# EAGLE design SAS_rev04 (EAGLE 7.5.0)
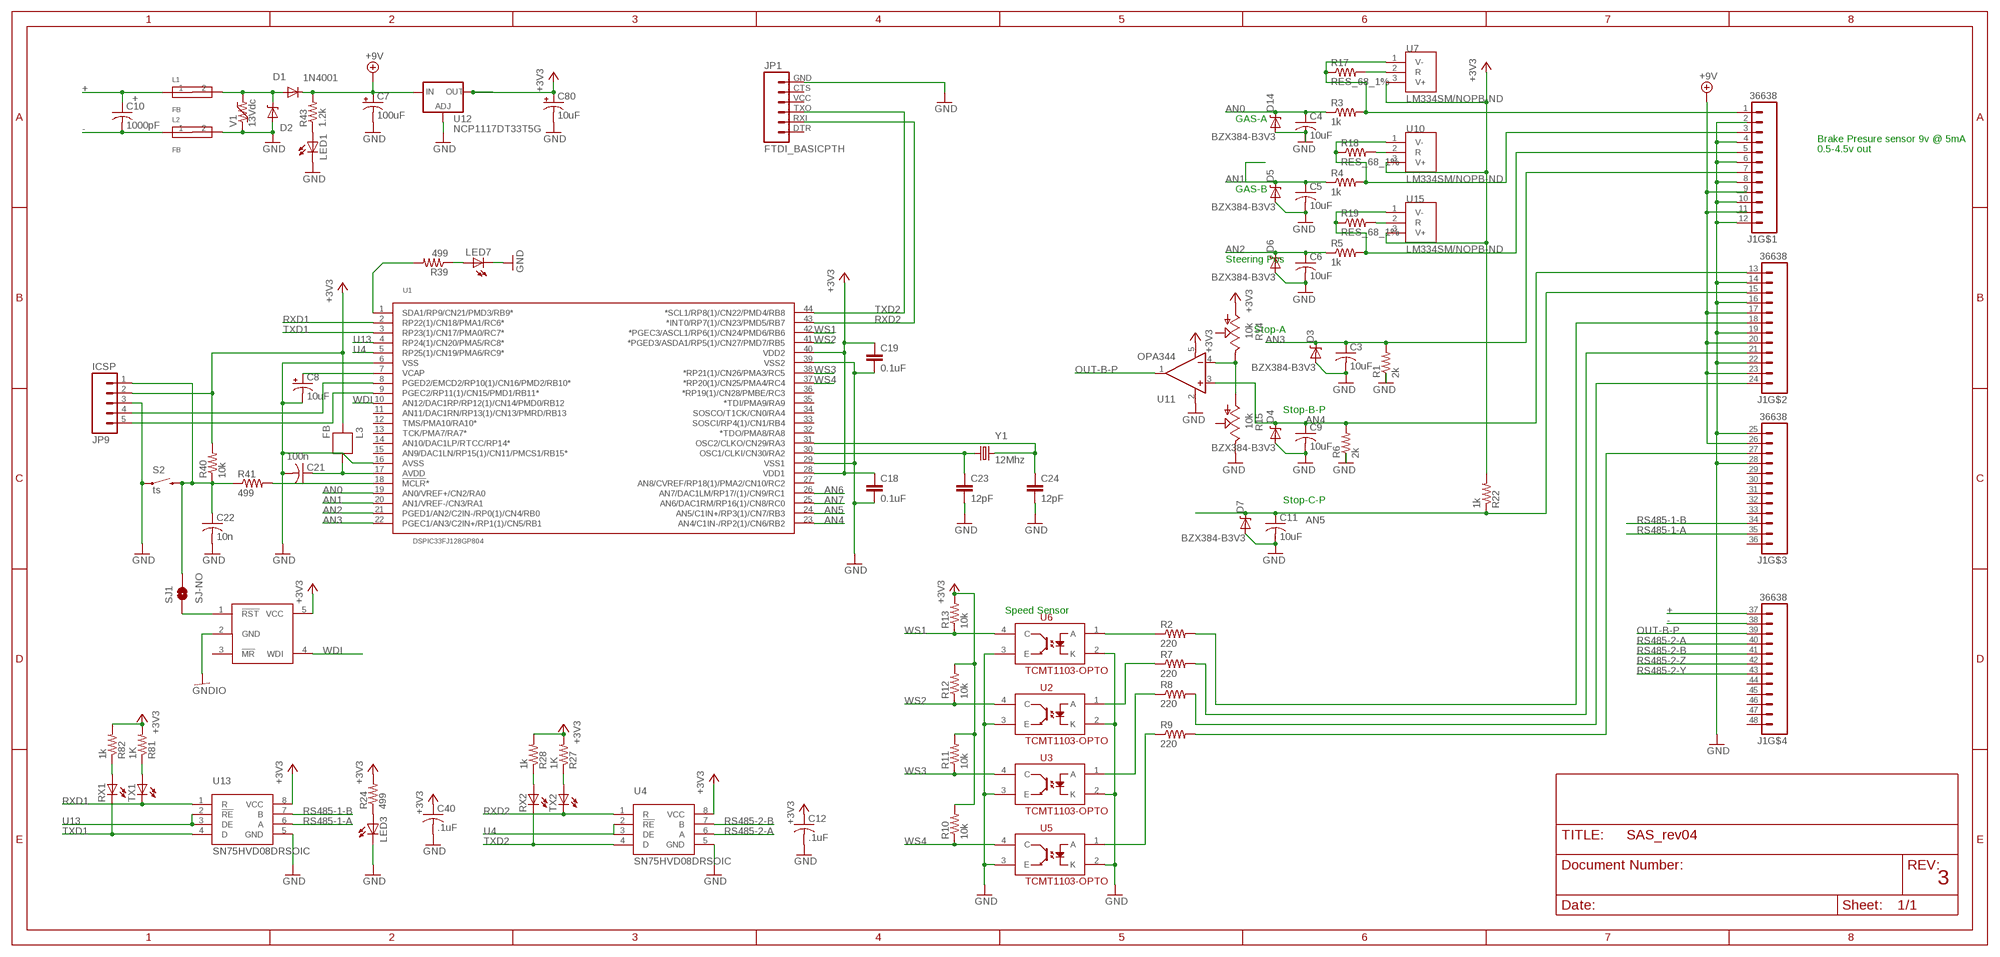
[diagram p0: schematic, sheet 1]

## Parts
C3  10uF  C-USC0805  [C0805]
C4  10uF  C-USC0805  [C0805]
C5  10uF  C-USC0805  [C0805]
C6  10uF  C-USC0805  [C0805]
C7  100uF  CAP_POL7343  [EIA7343]
C8  10uF  CAP-POL_10UF_16V  [EIA3216-16V]
C9  10uF  C-USC0805  [C0805]
C10  1000pF  C-USC1825  [C1825]
C11  10uF  C-USC0805  [C0805]
C12  .1uF  CAP_0.1UF_50V  [0603]
C18  0.1uF  CAP0805  [0805]
C19  0.1uF  CAP0805  [0805]
C21  100n  C-USC0805  [C0805]
C22  10n  CAP_10NF_50V  [0603]
C23  12pF  CAP0805  [0805]
C24  12pF  CAP0805  [0805]
C40  .1uF  CAP_0.1UF_50V  [0603]
C80  10uF  POLCAP  [POLC1206]
D1  1N4001  DIODE-SOD123  [SOD123]
D2  MM5Z30  [SOD-523F]
D3  BZX384-B3V3  DIODE-ZENER-BZT52  [SOD-323]
D4  BZX384-B3V3  DIODE-ZENER-BZT52  [SOD-323]
D5  BZX384-B3V3  DIODE-ZENER-BZT52  [SOD-323]
D6  BZX384-B3V3  DIODE-ZENER-BZT52  [SOD-323]
D7  BZX384-B3V3  DIODE-ZENER-BZT52  [SOD-323]
D14  BZX384-B3V3  DIODE-ZENER-BZT52  [SOD-323]
J1  36638  [36638]
JP1  FTDI_BASICPTH  [FTDI_BASIC]
JP9  ICSP  M05LOCK_LONGPADS  [1X05_LOCK_LONGPADS]
L1  FB  FERITEBEAD  [0603]
L2  FB  FERITEBEAD  [0603]
L3  FB  [0603]
LED1  LEDCHIP-LED0805  [CHIP-LED0805]
LED3  LEDCHIP-LED0805  [CHIP-LED0805]
LED7  LEDCHIP-LED0805  [CHIP-LED0805]
R1  2k  RES_2K_1%_0805  [0805]
R2  220  RES_220_1%  [0603]
R3  1k  RES_1K_5%  [0603]
R4  1k  RES_1K_5%  [0603]
R5  1k  RES_1K_5%  [0603]
R6  2k  RES_2K_1%_0805  [0805]
R7  220  RES_220_1%  [0603]
R8  220  RES_220_1%  [0603]
R9  220  RES_220_1%  [0603]
R10  10k  RES_10K_1%  [0603]
R11  10k  RES_10K_1%  [0603]
R12  10k  RES_10K_1%  [0603]
R13  10k  RES_10K_1%  [0603]
R14  10k  POT_10K_POT  [PVG3]
R15  10k  POT_10K_POT  [PVG3]
R17  RES_68_1%  [0603]
R18  RES_68_1%  [0603]
R19  RES_68_1%  [0603]
R22  1k  RES_1K_1%_0805  [0805]
R24  499  RES_499_1%  [0603]
R27  1K  RES_1K_1%_0805  [0805]
R28  1k  RES_1K_1%_0805  [0805]
R39  499  RES_499_1%  [0603]
R40  10k  RES_10K_1%_0805  [0805]
R41  499  RES_499_1%_0805  [0805]
R43  1.2k  RES_1.2K_1%_0805  [0805]
R81  1K  RES_1K_5%  [0603]
R82  1k  RES_1K_5%  [0603]
RX1  LEDCHIPLED_0805  [CHIPLED_0805]
RX2  LEDCHIPLED_0805  [CHIPLED_0805]
S2  ts  SWITCH-MOMENTARY-2PTH  [TACTILE-PTH]
SJ1  SJ-NO  SOLDERJUMPERNO  [SJ_2S-NO]
TX1  LEDCHIPLED_0805  [CHIPLED_0805]
TX2  LEDCHIPLED_0805  [CHIPLED_0805]
U1  DSPIC33FJ128GP804  [TQFP-44]
U2  TCMT1103-OPTO  [SSOP-4]
U3  TCMT1103-OPTO  [SSOP-4]
U4  SN75HVD08DRSOIC  [SO-8]
U5  TCMT1103-OPTO  [SSOP-4]
U6  TCMT1103-OPTO  [SSOP-4]
U7  LM334SM/NOPB-ND  [SO-8]
U9  MAX823  [SOT23-5L]
U10  LM334SM/NOPB-ND  [SO-8]
U11  OPA344  [SOT23-5]
U12  NCP1117DT33T5G  V_REG_317DPACK  [V-REG_DPACK]
U13  SN75HVD08DRSOIC  [SO-8]
U15  LM334SM/NOPB-ND  [SO-8]
V1  13Vdc  VAR-RES  [0603]
Y1  12Mhz  CRYSTAL5X3  [CRYSTAL-SMD-5X3]

## Nets
+: C10.1 J1.37 L1.1
+3V3: C12.1(+) C18.1 C19.1 C40.1(+) C80.1(+) JP9.2 L3.2 R10.2 R11.2 R12.2 R13.2 R14.1(CW) R22.2 R24.2 R27.2 R28.2 R40.2 R81.2 R82.2 U1.28(VDD1) U1.40(VDD2) U4.8(VCC) U7.3(V+) U9.5(VCC) U10.3(V+) U11.5(V+) U12.4(OUT) U13.8(VCC) U15.3(V+)
+9V: C7.A(+) D1.C J1.9 J1.11 J1.17 J1.20 J1.23 J1.26 R43.2 U12.3(IN)
-: C10.2 J1.38 L2.1
AN0: C4.1 D14.1(C) R3.1 U1.19(AN0/VREF+/CN2/RA0)
AN1: C5.1 D5.1(C) R4.1 U1.20(AN1/VREF-/CN3/RA1)
AN2: C6.1 D6.1(C) R5.1 U1.21(PGED1/AN2/C2IN-/RP0(1)/CN4/RB0)
AN3: C3.1 D3.1(C) J1.7 R1.2 U1.22(PGEC1/AN3/C2IN+/RP1(1)/CN5/RB1)
AN4: C9.1 D4.1(C) J1.13 R6.2 U1.23(AN4/C1IN-/RP2(1)/CN6/RB2) U11.3(+IN)
AN5: C11.1 D7.1(C) J1.15 R22.1 U1.24(AN5/C1IN+/RP3(1)/CN7/RB3)
AN6: U1.26(AN7/DAC1LM/RP17/(1)/CN9/RC1)
AN7: U1.25(AN6/DAC1RM/RP16(1)/CN8/RC0)
GHT: D1.A D2.C L1.2 V1.2
GND: C3.2 C4.2 C5.2 C6.2 C7.C(-) C8.C(-) C9.2 C11.2 C12.2(-) C18.2 C19.2 C21.2 C22.2(-) C23.2 C24.2 C40.2(-) C80.2(-) D2.A D3.2(A) D4.2(A) D5.2(A) D6.2(A) D7.2(A) D14.2(A) J1.2 J1.4 J1.6 J1.8 J1.10 J1.12 J1.14 J1.16 J1.19 J1.22 J1.25 J1.28 JP1.GND JP9.3 L2.2 LED1.C LED3.C LED7.C R1.1 R6.1 R15.3(CCW) S2.1 U1.6(VSS) U1.16(AVSS) U1.29(VSS1) U1.39(VSS2) U2.2(K) U2.3(E) U3.2(K) U3.3(E) U4.5(GND) U5.2(K) U5.3(E) U6.2(K) U6.3(E) U11.2(V-) U12.1(ADJ) U13.5(GND) V1.1
GNDIO: U9.2(GND)
N$1: C22.1(+) JP9.1 R40.1 R41.1 S2.3 SJ1.2
N$2: C21.1 L3.1 U1.17(AVDD)
N$3: J1.1 R3.2 R17.1 U7.1(V-)
N$4: C8.A(+) U1.7(VCAP)
N$5: R39.2 U1.1(SDA1/RP9/CN21/PMD3/RB9*)
N$6: LED1.A R43.1
N$7: R17.2 U7.2(R)
N$8: R41.2 U1.18(!MCLR!*)
N$9: R14.3(CCW) R15.1(CW) U11.4(-IN)
N$10: SJ1.1 U9.1(!RST)
N$11: J1.18 R2.2
N$12: JP9.4 U1.8(PGED2/EMCD2/RP10(1)/CN16/PMD2/RB10*)
N$15: JP9.5 U1.9(PGEC2/RP11(1)/CN15/PMD1/RB11*)
N$16: J1.21 R7.2
N$17: J1.24 R8.2
N$18: J1.27 R9.2
N$19: R2.1 U6.1(A)
N$20: R7.1 U2.1(A)
N$21: R8.1 U3.1(A)
N$22: R9.1 U5.1(A)
N$24: R18.2 U10.2(R)
N$25: LED3.A R24.1
N$28: J1.3 R4.2 R18.1 U10.1(V-)
N$29: J1.5 R5.2 R19.1 U15.1(V-)
N$31: R27.1 TX2.A
N$32: R28.1 RX2.A
N$34: R19.2 U15.2(R)
N$37: LED7.A R39.1
N$39: C24.1 U1.31(OSC2/CLKO/CN29/RA3) Y1.3
N$40: C23.1 U1.30(OSC1/CLKI/CN30/RA2) Y1.1
N$86: R81.1 TX1.A
N$87: R82.1 RX1.A
OUT-B-P: J1.39 U11.1(OUT)
RS485-1-A: J1.35 U13.6(A)
RS485-1-B: J1.34 U13.7(B)
RS485-2-A: J1.40 U4.6(A)
RS485-2-B: J1.41 U4.7(B)
RS485-2-Y: J1.43
RS485-2-Z: J1.42
RXD1: TX1.C U1.2(RP22(1)/CN18/PMA1/RC6*) U13.1(R)
RXD2: JP1.RXI TX2.C U1.43(*INT0/RP7(1)/CN23/PMD5/RB7) U4.1(R)
TXD1: RX1.C U1.3(RP23(1)/CN17/PMA0/RC7*) U13.4(D)
TXD2: JP1.TXO RX2.C U1.44(*SCL1/RP8(1)/CN22/PMD4/RB8) U4.4(D)
U4: U1.5(RP25(1)/CN19/PMA6/RC9*) U4.2(!RE) U4.3(DE)
U13: U1.4(RP24(1)/CN20/PMA5/RC8*) U13.2(!RE) U13.3(DE)
WDI: U1.10(AN12/DAC1RP/RP12(1)/CN14/PMD0/RB12) U9.4(WDI)
WS1: R13.1 U1.42(*PGEC3/ASCL1/RP6(1)/CN24/PMD6/RB6) U6.4(C)
WS2: R12.1 U1.41(*PGED3/ASDA1/RP5(1)/CN27/PMD7/RB5) U2.4(C)
WS3: R11.1 U1.38(*RP21(1)/CN26/PMA3/RC5) U3.4(C)
WS4: R10.1 U1.37(*RP20(1)/CN25/PMA4/RC4) U5.4(C)
Unconnected: J1.29 J1.30 J1.31 J1.32 J1.33 J1.36 J1.44 J1.45 J1.46 J1.47 J1.48 JP1.CTS JP1.DTR JP1.VCC R14.2(W) R15.2(W) U1.11(AN11/DAC1RN/RP13(1)/CN13/PMRD/RB13) U1.12(TMS/PMA10/RA10*) U1.13(TCK/PMA7/RA7*) U1.14(AN10/DAC1LP/RTCC/RP14*) U1.15(AN9/DAC1LN/RP15(1)/CN11/PMCS1/RB15*) U1.27(AN8/CVREF/RP18(1)/PMA2/CN10/RC2) U1.32(*TDO/PMA8/RA8) U1.33(SOSCI/RP4(1)/CN1/RB4) U1.34(SOSCO/T1CK/CN0/RA4) U1.35(*TDI/PMA9/RA9) U1.36(*RP19(1)/CN28/PMBE/RC3) U9.3(!MR)

## Notes on the sheet
- GAS-A
- Brake Presure sensor 9v @ 5mA
- 0.5-4.5v out
- GAS-B
- Steering Pos
- Stop-A
- Stop-B-P
- Stop-C-P
- Speed Sensor
- 3

## Library data of the parts
C3-C6 C9-C11 C21 = adafruit:C-US: CAPACITOR, American symbol
C7 = SparkFun-Capacitors:CAP_POL: Capacitor Polarized These are standard SMD and PTH capacitors. Normally 10uF, 47uF, and 100uF in electrolytic and tantalum varieties. Always verify the external diameter of the through hole cap, it varies with capacity, voltage, and manufacturer. The EIA devices should be standard.
C8 = FSAE Electric:CAP-POL; PARTNO: T491A106M016AT
C12 C40 = FSAE Electric:CAP; PARTNO: CC0603ZRY5V9BB104
C18 C19 C23 C24 = SparkFun-Capacitors:CAP: Capacitor Standard 0603 ceramic capacitor, and 0.1" leaded capacitor.
C22 = FSAE Electric:CAP; PARTNO: CL10F103ZB8NNNC
C80 = RJ's_parts:POLCAP
D1 = diode:DIODE-: DIODE
D2 = EmEndev:MM5Z30
D3-D7 D14 = SparkFun:DIODE-ZENER: Zener Diode Production Part - 8199 3.4V Zener Voltage
J1 = FSAE Electric:36638; PARTNO: 0366380002
JP1 = SparkFun-Connectors:FTDI_BASIC: FTDI Basic header with labels
JP9 = SparkFun-Connectors:M05: Header 5 Standard 5-pin 0.1" header. Use with straight break away headers (SKU : PRT-00116), right angle break away headers (PRT-00553), swiss pins (PRT-00743), machine pins (PRT-00117), and female headers (PRT-00115). Molex polarized connector foot print use with SKU : PRT-08230 with associated crimp pins and housings.
L1 L2 = EmEndev:FERITEBEAD
L3 = SparkFun-Passives:FB
LED1 LED3 LED7 RX1 RX2 TX1 TX2 = adafruit:LED: LED OSRAM: - CHIPLED LG R971, LG N971, LY N971, LG Q971, LY Q971, LO R971, LY R971 LH N974, LH R974 LS Q976, LO Q976, LY Q976 LO Q996 - Hyper CHIPLED LW Q18S LB Q993, LB Q99A, LB R99A - SideLED LS A670, LO A670, LY A670, LG A670, LP A670 LB A673, LV A673, LT A673, LW A673 LH A674 LY A675 LS A676, LA A676, LO A676, LY A676, LW A676 LS A679, LY A679, LG A679 - Hyper Micro SIDELED® LS Y876, LA Y876, LO Y876, LY Y876 LT Y87S - SmartLED LW L88C, LW L88S LB L89C, LB L89S, LG L890 LS L89K, LO L89K, LY L89K LS L896, LA L896, LO L896, LY L896 - TOPLED LS T670, LO T670, LY T670, LG T670, LP T670 LSG T670, LSP T670, LSY T670, LOP T670, LYG T670 LG T671, LOG T671, LSG T671 LB T673, LV T673, LT T673, LW T673 LH T674 LS T676, LA T676, LO T676, LY T676, LB T676, LH T676, LSB T676, LW T676 LB T67C, LV T67C, LT T67C, LS T67K, LO T67K, LY T67K, LW E67C LS E67B, LA E67B, LO E67B, LY E67B, LB E67C, LV E67C, LT E67C LW T67C LS T679, LY T679, LG T679 LS T770, LO T770, LY T770, LG T770, LP T770 LB T773, LV T773, LT T773, LW T773 LH T774 LS E675, LA E675, LY E675, LS T675 LS T776, LA T776, LO T776, LY T776, LB T776 LHGB T686 LT T68C, LB T68C - Hyper Mini TOPLED® LB M676 - Mini TOPLED Santana® LG M470 LS M47K, LO M47K, LY M47K Source: http://www.osram.convergy.de/
R1 R6 = FSAE Eletric:RES; PARTNO: RC0805FR-072KL
R2 R7-R9 = FSAE Electric:RES: Resistors; PARTNO: RC0603FR-07220RL
R3-R5 R81 R82 = FSAE Electric:RES: Resistors; PARTNO: RC0603JR-071KL
R10-R13 = FSAE Electric:RES: Resistors; PARTNO: RC0603FR-0710KL
R14 R15 = FSAE Electric:POT; PARTNO: PVG3A103C01R00
R17-R19 = FSAE Electric:RES: Resistors; PARTNO: CRCW060368R0FKEA
R22 R27 R28 = FSAE Eletric:RES; PARTNO: RC0805FR-071KL
R24 R39 = FSAE Electric:RES: Resistors; PARTNO: RC0603FR-07499RL
R40 = FSAE Eletric:RES; PARTNO: RC0805FR-0710KL
R41 = FSAE Eletric:RES; PARTNO: RC0805FR-07499RL
R43 = FSAE Electric:RES: Resistors; PARTNO: RC0805FR-071K2L
S2 = SparkFun-Electromechanical:SWITCH-MOMENTARY-2: Various NO switches- pushbuttons, reed, etc
SJ1 = SparkFun-Passives:SOLDERJUMPER: Solder Jumper Standard SMD solder jumper. Used to automate production. Two varients : Normally Open and Normally Closed are the same, but have different paste layers. NC will have a large amount of paste and should jumper during reflow.
U1 = FSAE Electric:DSPIC33FJ128GP804; PARTNO: DSPIC33FJ128GP804-I/PT
U2 U3 U5 U6 = SparkFun-DiscreteSemi:TCMT1103-OPTO: Optoisolator- NPN output
U4 U13 = FSAE Electric:SN75HVD08DR; PARTNO: SN75176BDR
U7 U10 U15 = FSAE Electric:LM334: Current Source IC 3% 8-SO View on DigiKey <http://www.digikey.com/product-detail/en/LM334SM%2FNOPB/LM334SM%2FNOPB-ND/363905>; PARTNO: LM334SM/NOPB-ND
U9 = NASA_LIB:MAX823
U11 = SparkFun-AnalogIC:OPA344: Single gate rail-to-rail output op-amp. Inputs extend 300mV past rails.
U12 = SparkFun-PowerIC:V_REG_317: Voltage Regulator Standard LM317 adjustable voltage regulator. AOI (Adjust Output Input). Google 'LM317 Calculator' for easy to use app to get the two resistor values needed. 240/720 for 5V output. 240/390 for 3.3V output. Spark Fun Electronics SKU : COM-00527
V1 = EmEndev:VAR-RES
Y1 = SparkFun-FreqCtrl:CRYSTAL: Various standard crystals. Proven footprints. Spark Fun Electronics SKU : COM-00534

## Board
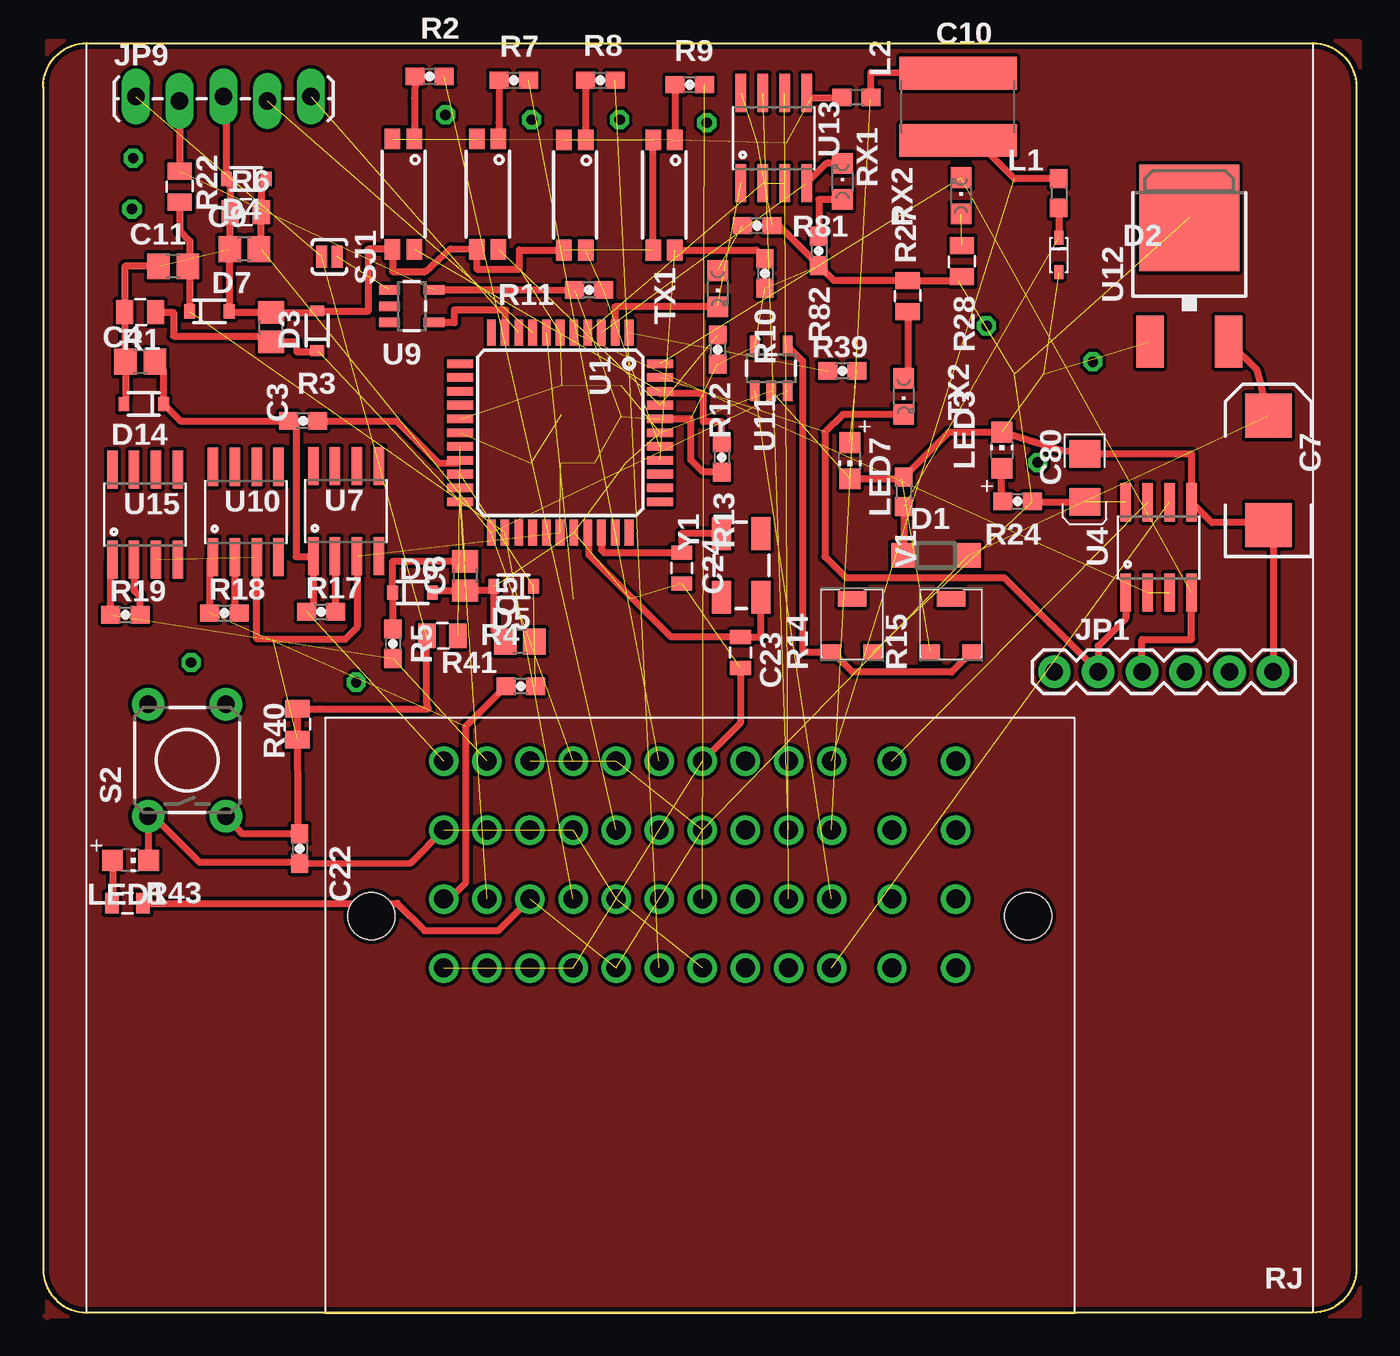
[diagram p1: board, top side]
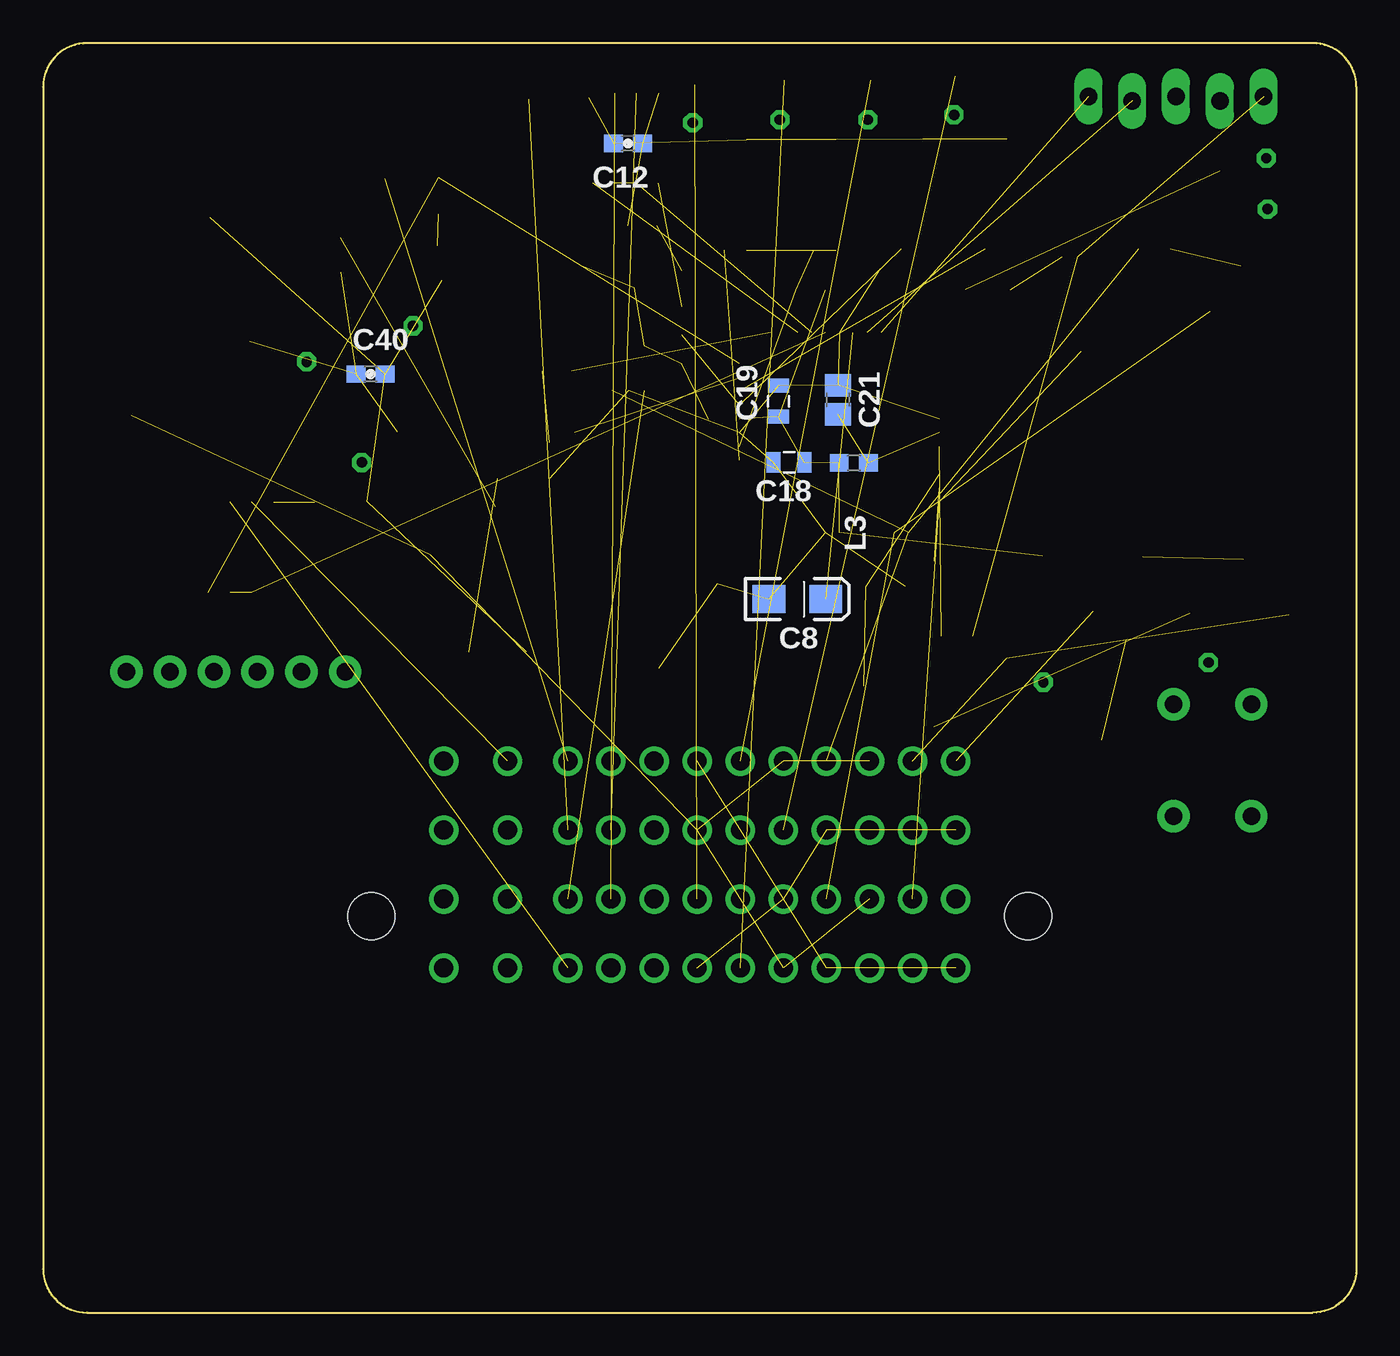
[diagram p2: board, bottom side, seen from below]

Size 76.2 x 73.66 mm. Coordinates in mm from the lower left corner, seen from the top.
Copper layers (1*16): Top 0.035mm / dielectric 1.5mm / Bottom 0.035mm
Design rules "SparkFun": minimum track width 8mil, minimum drill 20mil, track to track 8mil, track to pad 8mil, pad to pad 8mil, via to via 8mil, smd to smd 8mil, copper to edge 10mil, drill to drill 8mil, minimum pad ring 12mil, minimum via ring 10mil, stop-mask expansion 4mil, vias tented up to drill 25mil, thermal gap 10mil

### Footprints (pad centres in the part's own frame; a part is rotated, then mirrored left to right if it is on the bottom)
C0805 = smd 1.3 x 1.5: 1 -0.85,0; 2 0.85,0
EIA7343 = smd 2.55 x 2.7: A 3.17,0; C -3.17,0
EIA3216-16V = smd 1.9 x 1.6: A 1.65,0; C -1.65,0
C1825 = smd 1.9 x 6.8: 1 -1.95,0; 2 1.95,0
0603 = smd 1.1 x 1: 1 -0.85,0; 2 0.85,0
0805 = smd 0.8 x 1.2: 1 -0.9,0; 2 0.9,0
POLC1206 = smd 1.6 x 1.8: 1 -1.4,0; 2 1.4,0
SOD123 = smd 1.4 x 1.4: A 1.9,0; C -1.9,0
SOD-523F = smd 0.8 x 0.5: A -1,0; C 1,0
SOD-323 = smd 0.63 x 0.83: 1 -1.15,0; 2 1.15,0
36638 = drill 1.1: 1 -14.85,32; 2 -14.85,28; 3 -14.85,24; 4 -14.85,20; 5 -12.35,32; 6 -12.35,28; 7 -12.35,24; 8 -12.35,20; 9 -9.85,32; 10 -9.85,28; 11 -9.85,24; 12 -9.85,20; 13 -7.35,32; 14 -7.35,28; 15 -7.35,24; 16 -7.35,20; 17 -4.85,32; 18 -4.85,28; 19 -4.85,24; 20 -4.85,20; 21 -2.35,32; 22 -2.35,28; 23 -2.35,24; 24 -2.35,20; 25 0.15,32; 26 0.15,28; 27 0.15,24; 28 0.15,20; 29 2.65,32; 30 2.65,28; 31 2.65,24; 32 2.65,20; 33 5.15,32; 34 5.15,28; 35 5.15,24; 36 5.15,20; 37 7.65,32; 38 7.65,28; 39 7.65,24; 40 7.65,20; 41 11.15,32; 42 11.15,28; 43 11.15,24; 44 11.15,20; 45 14.85,32; 46 14.85,28; 47 14.85,24; 48 14.85,20 | hole 2.7: -19.05,23; 19.05,23
FTDI_BASIC = drill 1.016 pad 1.88: CTS 10.16,0; DTR 0,0; GND 12.7,0; RXI 2.54,0; TXO 5.08,0; VCC 7.62,0
1X05_LOCK_LONGPADS = drill 1.016 long: 1 0,0; 2 2.54,-0.254; 3 5.08,0; 4 7.62,-0.254; 5 10.16,0
CHIP-LED0805 = smd 1.2 x 1.2: A 0,-1.05; C 0,1.05
0805' = smd 1 x 1.4: 1 -0.9,0; 2 0.9,0
PVG3 = smd 1.1 x 0.9: 1 1.2,-1.5; 3 -1.2,-1.5 | smd 1.65 x 0.9: 2 0,1.6
CHIPLED_0805 = smd 1.2 x 1.2: A 0,-1.05; C 0,1.05
TACTILE-PTH = drill 1.016 pad 1.88: 1 -3.251,2.261; 2 3.251,2.261; 3 -3.251,-2.261; 4 3.251,-2.261
SJ_2S-NO = smd 0.635 x 1.27: 1 -0.45,0; 2 0.45,0
TQFP-44 = smd 1.5 x 0.5: 1 -5.8,4; 2 -5.8,3.2; 3 -5.8,2.4; 4 -5.8,1.6; 5 -5.8,0.8; 6 -5.8,0; 7 -5.8,-0.8; 8 -5.8,-1.6; 9 -5.8,-2.4; 10 -5.8,-3.2; 11 -5.8,-4; 23 5.8,-4; 24 5.8,-3.2; 25 5.8,-2.4; 26 5.8,-1.6; 27 5.8,-0.8; 28 5.8,0; 29 5.8,0.8; 30 5.8,1.6; 31 5.8,2.4; 32 5.8,3.2; 33 5.8,4 | smd 0.5 x 1.5: 12 -4,-5.8; 13 -3.2,-5.8; 14 -2.4,-5.8; 15 -1.6,-5.8; 16 -0.8,-5.8; 17 0,-5.8; 18 0.8,-5.8; 19 1.6,-5.8; 20 2.4,-5.8; 21 3.2,-5.8; 22 4,-5.8; 34 4,5.8; 35 3.2,5.8; 36 2.4,5.8; 37 1.6,5.8; 38 0.8,5.8; 39 0,5.8; 40 -0.8,5.8; 41 -1.6,5.8; 42 -2.4,5.8; 43 -3.2,5.8; 44 -4,5.8
SSOP-4 = smd 1.2 x 0.9: 1 -3.2,0.67; 2 -3.2,-0.6; 3 3.2,-0.6; 4 3.2,0.67
SO-8 = smd 0.61 x 2.21: 1 -1.905,-2.616; 2 -0.635,-2.616; 3 0.635,-2.616; 4 1.905,-2.616; 5 1.905,2.616; 6 0.635,2.616; 7 -0.635,2.616; 8 -1.905,2.616
SOT23-5L = smd 0.55 x 1.2: 1 -0.95,-1.3; 2 0,-1.3; 3 0.95,-1.3; 4 0.95,1.3; 5 -0.95,1.3
SOT23-5 = smd 0.55 x 1.2: 1 -0.95,-1.3; 2 0,-1.3; 3 0.95,-1.3; 4 0.95,1.3; 5 -0.95,1.3
V-REG_DPACK = smd 1.6 x 3: 1 -2.28,-4.8; 3 2.28,-4.8 | smd 5.8 x 6.2: 4 0,2.38
CRYSTAL-SMD-5X3 = smd 1.9 x 1.1: 1 -1.85,-1.15; 2 1.85,-1.15; 3 1.85,1.15; 4 -1.85,1.15

### Placement (x,y rotation side)
C3  13.23,57.18 90 top
C4  5.64,55.17 180 top
C5  27.66,38.94 180 top
C6  24.49,42.75 270 top
C7  71.09,48.87 90 top
C8  32.44,41.4 0 bottom
C9  11.68,61.7 180 top
C10  53.09,69.96 90 top
C11  7.54,60.71 180 top
C12  42.27,67.84 180 bottom
C18  32.92,49.33 180 bottom
C19  33.53,52.88 90 bottom
C21  30.07,52.96 90 bottom
C22  14.88,26.92 270 top
C23  40.46,38.3 270 top
C24  37.06,43.21 270 top
C40  57.2,54.46 180 bottom
C80  60.43,48.43 90 top
D1  51.81,43.94 180 top
D2  58.93,61.36 90 top
D3  15.9,56.97 90 top
D4  11.79,65.79 180 top
D5  27.3,42.14 180 top
D6  21.44,41.78 0 top
D7  9.65,58.09 0 top
D14  5.84,52.72 180 top
J1  38.1,0 0 top
JP1  58.67,37.19 0 top
JP9  5.38,70.56 0 top
L1  58.93,64.95 270 top
L2  47.19,70.5 180 top
L3  29.16,49.3 180 bottom
LED1  5.08,26.24 270 top
LED3  55.63,50.04 0 top
LED7  46.81,49.43 180 top
R1  2k  [0805']  5.64,58.04 0 top
R2  22.43,71.73 0 top
R3  15.09,51.74 180 top
R4  27.71,36.35 180 top
R5  20.29,38.81 270 top
R6  2k  [0805']  11.76,63.86 0 top
R7  27.3,71.5 0 top
R8  32.33,71.5 0 top
R9  37.52,71.25 0 top
R10  41.88,60.3 270 top
R11  31.67,59.33 180 top
R12  39.14,55.88 270 top
R13  39.37,49.63 270 top
R14  46.94,39.83 0 top
R15  52.68,39.83 0 top
R17  16.13,40.67 0 top
R18  10.52,40.59 0 top
R19  4.78,40.49 0 top
R22  1k  [0805']  7.92,65.33 90 top
R24  56.54,47.07 0 top
R27  1K  [0805']  50.16,58.98 90 top
R28  1k  [0805']  53.31,61.01 270 top
R39  46.38,54.64 180 top
R40  10k  [0805']  14.76,34.14 270 top
R41  499  [0805']  23.16,39.27 0 top
R43  4.89,23.75 0 top
R81  41.43,63.07 0 top
R82  45.01,61.6 270 top
RX1  46.38,65.63 0 top
RX2  53.26,64.8 0 top
S2  8.36,32.05 90 top
SJ1  16.61,61.26 180 top
TX1  39.14,59.41 180 top
TX2  49.94,53.16 180 top
U1  30,51.05 270 top
U2  25.76,64.9 270 top
U3  30.81,64.85 270 top
U4  64.72,44.4 0 top
U5  35.99,64.85 270 top
U6  20.88,64.9 270 top
U7  17.58,46.51 0 top
U9  21.39,58.39 270 top
U10  11.76,46.46 0 top
U11  42.24,54.79 0 top
U12  66.5,61.14 0 top
U13  42.39,68.15 0 top
U15  5.92,46.3 0 top
U$2  [L-L]  -122.5,-10.34 0 top  (outside the outline)
V1  49.93,47.62 270 top
Y1  40.51,43.36 90 top

### Tracks (layer width: path | path; a pad name or v marks a point on that pad's centre or on a via)
+  (1 unrouted)
  Top 0.406: L1.1 56.36,65.79 54.03,68.12 53.21,68.12 C10.1
+3V3  (20 unrouted)
  Top 0.406: U9.5 28.77,59.34 R11.2 | R28.2 53.08,59.88 R27.2 45.87,59.88 R82.2 42.69,63.07 R81.2 | R13.2 38.29,48.78 37.59,49.48 37.59,51.85 U1.40 | JP9.2 R22.2 | R24.2 57.42,47.03 C80.1 | U7.3 18.21,39.75 17.53,39.07 13.33,39.07 12.39,39.09 U10.3
  pour Bottom: -76.15,45.8 -54.56,45.8 -54.56,28.02 -76.15,28.02
  pour Top: -76.15,45.8 -54.61,45.9 -54.61,28.12 -76.15,28.02
+9V  (7 unrouted)
  Top 0.406: U12.3 70.41,54.71 C7.A | R43.2 20.54,23.75 22.12,22.17 26.42,22.17 J1.11
-  (1 unrouted)
  Top 0.406: C10.2 48.02,71.96 L2.1 48.04,70.41 48.01,70.41
AN0
  Top 0.406: C4.1 6.99,54.67 D14.1 7.98,51.73 R3.1 20.52,51.74 22.96,49.3 24.04,49.3 U1.19
AN1  (3 unrouted)
AN2  (1 unrouted)
  Top 0.406: R5.1 20.29,39.67 D6.1 20.29,43.6 C6.1
AN3  (2 unrouted)
  Top 0.406: R1.2 7.57,58.04 7.57,56.67 13.23,56.67 C3.1 14.66,56.33 14.73,55.75 15.98,55.75 D3.1
AN4  (3 unrouted)
  Top 0.406: D4.1 12.66,65.79 R6.2 12.66,61.7 C9.1
AN5  (2 unrouted)
  Top 0.406: D7.1 8.5,60.71 C11.1 8.51,60.82 8.51,62.18 7.92,62.76 R22.1
GHT  (1 unrouted)
  Top 0.406: V1.2 49.93,43.97 D1.A | L1.2 D2.C
GND  (35 unrouted)
  Top 0.406: C11.2 4.74,60.71 R1.1 4.74,55.22 C4.2 4.79,52.81 D14.2 | JP9.3 10.64,70.41 D4.2 10.86,65.79 R6.1 10.83,63.86 C9.2 10.8,61.7 D7.2 10.8,58.03 C3.2 15.9,58.03 D3.2 15.9,58.09 18.85,58.09 18.85,61.7 U6.3 20.28,60.4 22.2,60.4 23.65,61.72 25.2,61.7 U2.3 25.16,60.55 27.63,60.55 27.63,61.65 U3.3 | U5.3 U5.2 | U13.5 44.56,70.5 L2.2 | LED7.C 49.84,48.38 V1.1 52.55,51.09 LED3.C 59.06,50.01 C80.2 66.62,49.83 U4.5 67.81,45.83 70.41,45.83 C7.C 71.37,45.7 JP1.GND | C23.2 40.46,34.21 J1.25 | D6.2 22.59,41.9 C6.2 25.91,41.9 D5.2 26.15,39.59 C5.2 | LED1.C 6.1,26.24 S2.1 6.4,28.8 9.07,26.14 14.26,26.14 C22.2 21.35,26.1 J1.2
  pour Bottom (rank 6): -130.25,77.93 -54.43,77.93 -54.43,-8.05 -130.63,-8.05
  pour Top (rank 6): -130.63,77.93 -54.43,77.93 -54.43,-8.05 -130.63,-8.05
N$1  (2 unrouted)
  Top 0.406: S2.3 11.56,27.79 C22.1 14.79,27.84 R40.1 16.06,35.03 22.35,35.03 22.26,35.44 R41.1
N$2  (2 unrouted)
N$3  (1 unrouted)
  Top 0.406: R17.1 15.67,41.06 U7.1 15.67,43.87 14.68,43.87 14.68,51.74 R3.2
N$4  (1 unrouted)
N$5  (1 unrouted)
N$6
  Top 0.406: LED1.A 4.03,23.75 R43.1
N$7
  Top 0.406: U7.2 16.94,40.7 R17.2
N$8  (1 unrouted)
N$9
  Top 0.406: R15.1 52.71,37.16 46.96,37.16 45.8,38.33 R14.3 44.25,38.33 44.07,38.43 44.07,55.21 U11.4
N$10  (1 unrouted)
N$11  (1 unrouted)
N$12  (1 unrouted)
N$13  (via drill 0.6)
  other vias: 28.35,69.21
N$14  (via drill 0.6)
  other vias: 33.45,69.21
N$15  (1 unrouted)
N$16  (1 unrouted)
N$17  (1 unrouted)
N$18  (1 unrouted)
N$19
  Top 0.406: R2.1 21.55,70.43 U6.1
N$20
  Top 0.406: R7.1 26.45,69.07 U2.1
N$21
  Top 0.406: R8.1 U3.1
N$22
  Top 0.406: R9.1 U5.1
N$23  (via drill 0.6)
  other vias: 38.51,69.04
N$24
  Top 0.406: U10.2 11.12,40.83 R18.2
N$25
  Top 0.406: R24.1 55.61,47.83 LED3.A
N$26  (via drill 0.6)
  other vias: 23.34,69.49
N$27  (via drill 0.6)
  other vias: 60.91,55.17
N$28  (1 unrouted)
  Top 0.406: U10.1 9.67,43.65 R18.1 | R4.2 24.51,34 24.51,24.92 23.59,24 J1.3
N$29  (2 unrouted)
  Top 0.406: R19.1 3.92,43.6 U15.1
N$30  (via drill 0.6)
  other vias: 5.16,64.03
N$31
  Top 0.406: R27.1 50.16,54.44 TX2.A
N$32  (1 unrouted)
N$33  (via drill 0.6)
  other vias: 5.23,66.98
N$34
  Top 0.406: U15.2 5.28,41.91 5.61,41.58 R19.2
N$35  (via drill 0.6)
  other vias: 8.59,37.72
N$36  (via drill 0.6)
  other vias: 18.16,36.58
N$37  (1 unrouted)
N$38  (via drill 0.6)
  other vias: 54.74,57.25
N$39
  Top 0.406: Y1.3 37.04,45.21 C24.1 36.26,44.09 32.56,44.09 32.4,44.26 U1.31
N$40
  Top 0.406: Y1.1 41.66,39.2 C23.1 36.44,39.2 31.67,43.97 31.67,45.18 U1.30
N$41  (via drill 0.6)
  other vias: 57.71,49.33
N$42
  pour Top: 0.08,-0.2 76.4,-0.2 76.4,73.76 0.23,73.76 0.23,-0.33
N$86  (1 unrouted)
N$87
  Top 0.406: RX1.A 45.01,64.58 R82.1
OUT-B-P  (1 unrouted)
RS485-1-A  (1 unrouted)
RS485-1-B  (1 unrouted)
RS485-2-A  (1 unrouted)
RS485-2-B  (1 unrouted)
RXD1  (1 unrouted)
  Top 0.406: TX1.C 33.17,58.36 U1.2
RXD2  (1 unrouted)
  Top 0.406: U4.1 62.81,40.28 61.21,38.68 JP1.RXI 55.75,42.65 46.58,42.65 45.36,43.87 45.36,51.08 46.4,52.11 TX2.C
TXD1  (1 unrouted)
  Top 0.406: RX1.C 45.45,66.68 U13.4
TXD2  (2 unrouted)
  Top 0.406: JP1.TXO 63.75,39.07 66.62,39.07 U4.4
U4  (2 unrouted)
U13  (2 unrouted)
WDI
  Top 0.406: U1.10 26.85,56.85 26.85,58.17 23.85,58.17 23.85,57.43 22.69,57.43 U9.4
WS1  (1 unrouted)
  Top 0.406: R13.1 39.37,51.69 38.3,51.69 38.3,53.31 35.8,53.31 U1.42
WS2  (2 unrouted)
WS3  (2 unrouted)
WS4  (1 unrouted)
  Top 0.406: U5.4 41.39,61.65 R10.1

### Text on the board
tPlace: D2 | RJ